# EAGLE design T00RA (EAGLE 9.6.1)
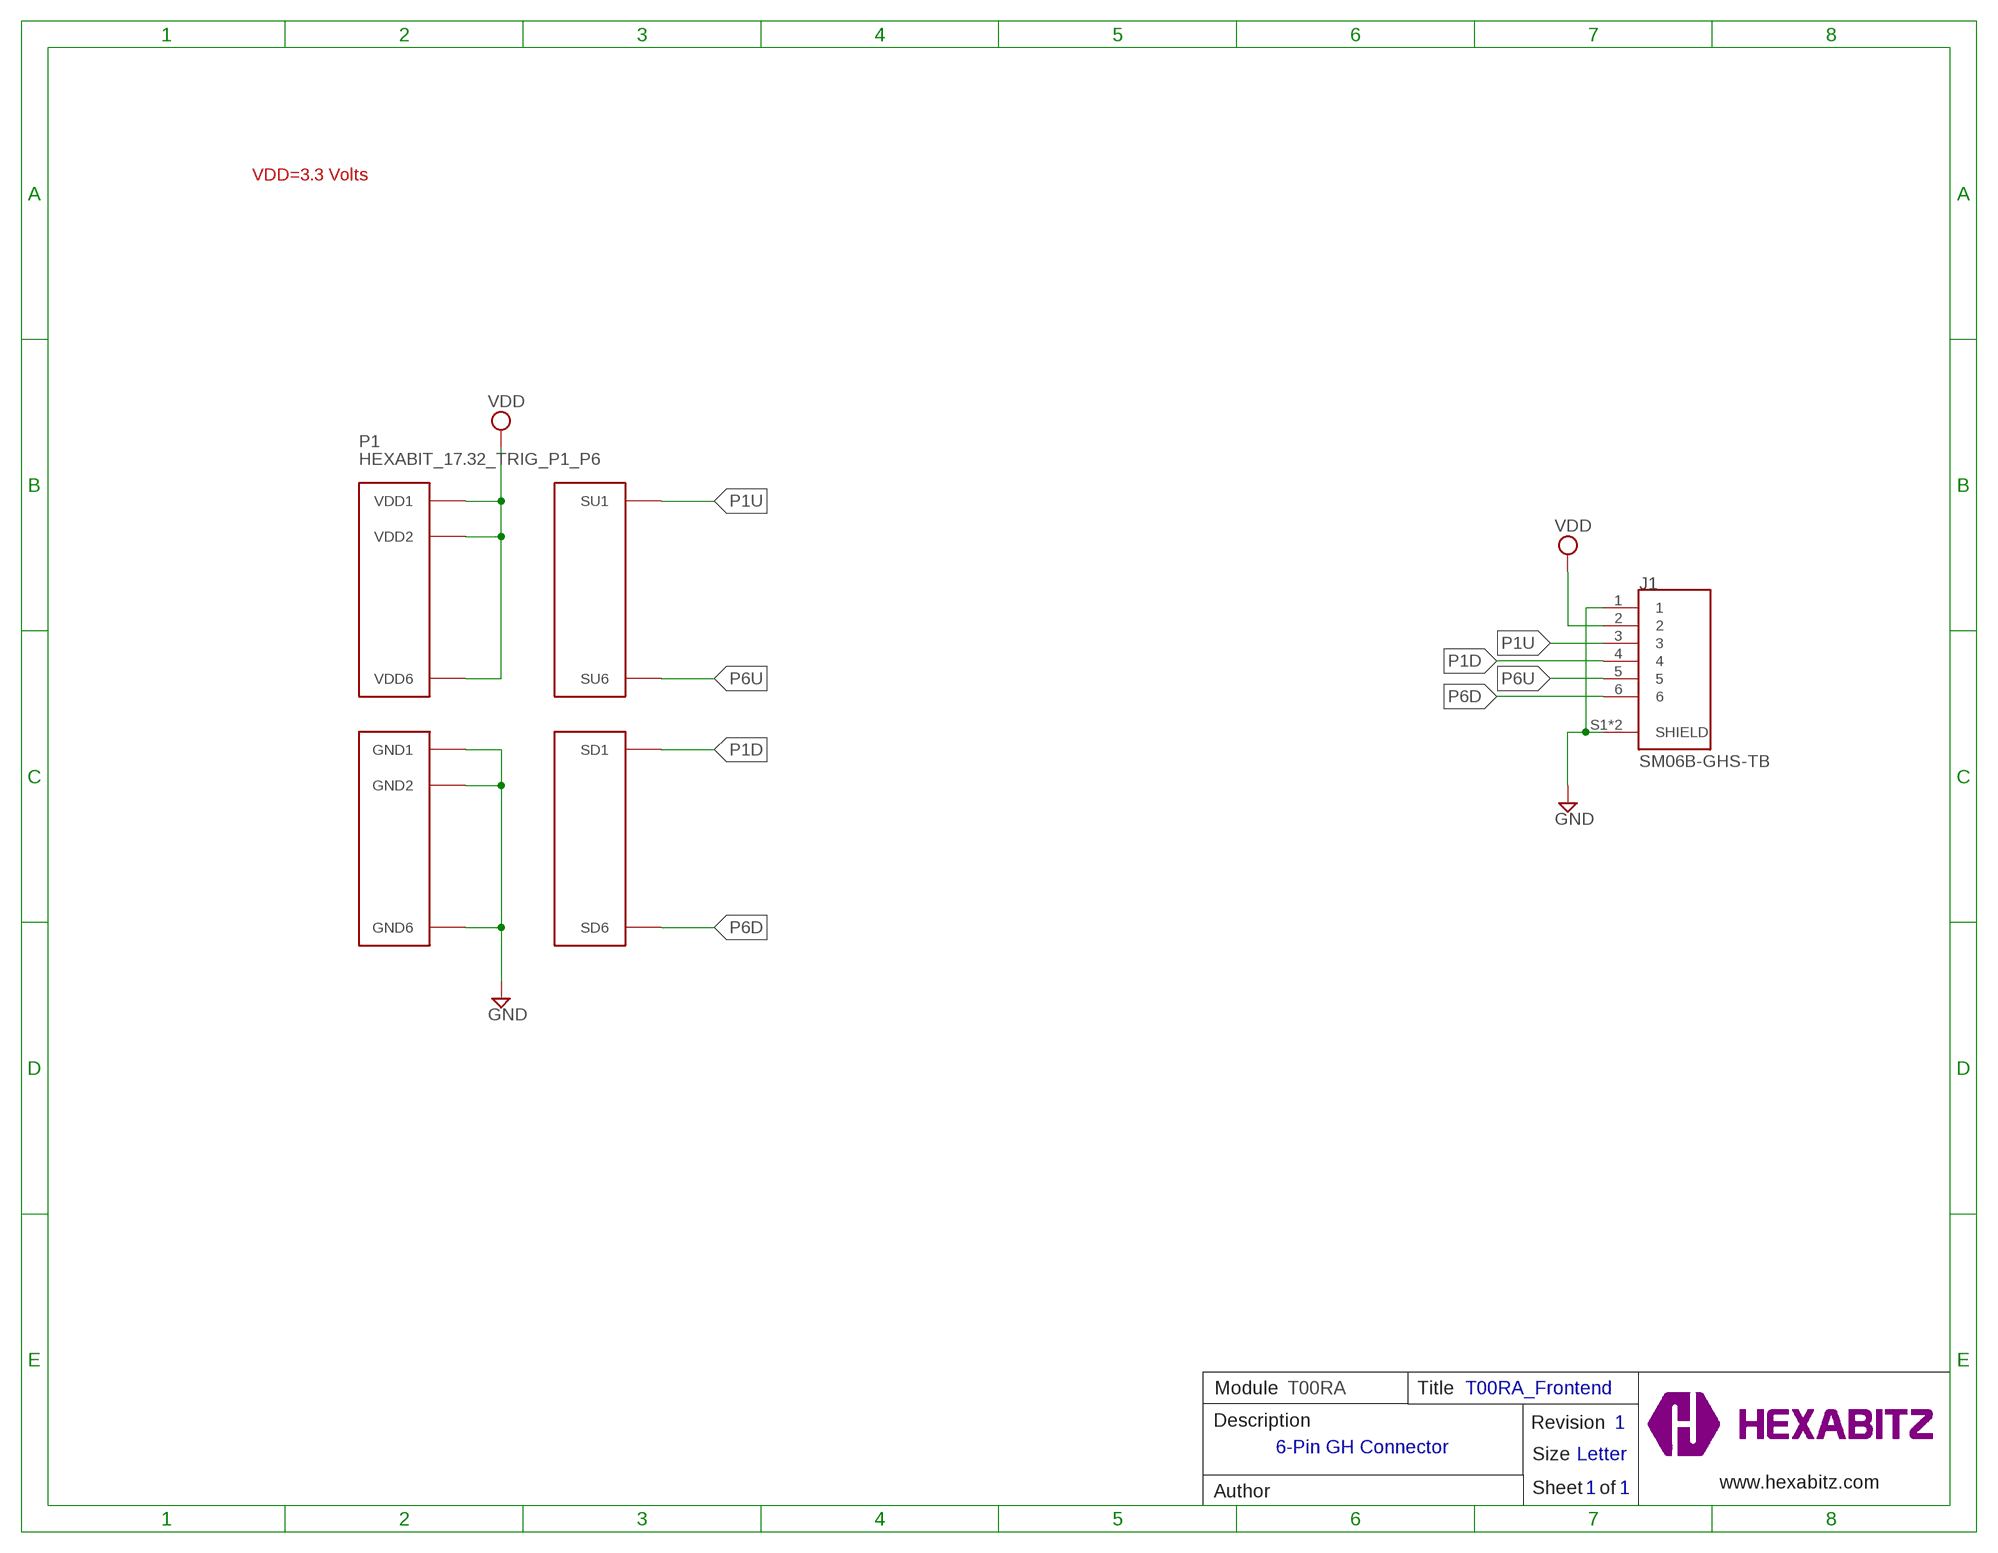
[diagram p0: schematic, sheet 1]

## Parts
J1  SM06B-GHS-TB  [JST_SM06B-GHS-TB]
P1  HEXABIT_17.32_TRIG_P1_P6  [HEXABIT_17.32_TRIG_P1_P6]

## Nets
GND: J1.1 J1.S1(SHIELD) J1.S2(SHIELD) P1.PAD_PD7(GND1) P1.PAD_PD8(GND2) P1.PAD_PD12(GND6)
P1D: J1.4 P1.PAD_PD1(SD1)
P1U: J1.3 P1.PAD_PU1(SU1)
P6D: J1.6 P1.PAD_PD6(SD6)
P6U: J1.5 P1.PAD_PU6(SU6)
VDD: J1.2 P1.PAD_PU7(VDD1) P1.PAD_PU8(VDD2) P1.PAD_PU12(VDD6)

## Notes on the sheet
- VDD=3.3 Volts
- Module | T00RA | Title | T00RA_Frontend
- Description | Revision | 1
- 6-Pin GH Connector
- Size | Letter
- www.hexabitz.com
- Author | Sheet   of | 1 | 1

## Library data of the parts
J1 = HEXABITZ_CONNECTION_PARTS:SM06B-GHS-TB: Conn Header Gh Side Entry 6pos 1.25mm
P1 = hexabitz_connectors:HEXABIT_17.32_TRIG_P1_P6: Hexabitz Hexagon Module Connector Hexagon side length = 17.32mm.

## Board
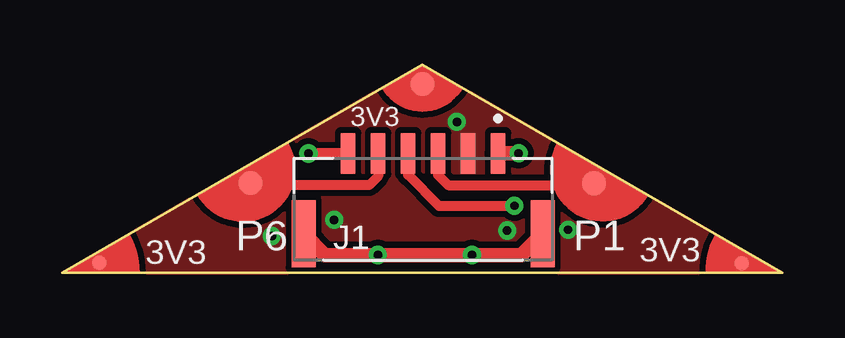
[diagram p1: board, top side]
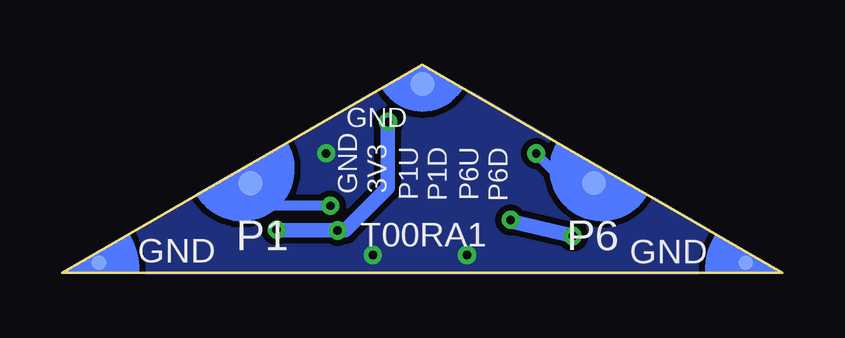
[diagram p2: board, bottom side, seen from below]

Size 30 x 8.66 mm. Coordinates in mm from the lower left corner, seen from the top.
Copper layers (1*16): Top 0.035mm / dielectric 1.5mm / Bottom 0.035mm
Design rules "2_layer *": minimum track width 7mil, minimum drill 10mil, track to track 6mil, track to pad 6mil, pad to pad 6mil, via to via 6mil, smd to smd 0mil, copper to edge 0mil, drill to drill 8mil, minimum pad ring 10mil, minimum via ring 8mil, stop-mask expansion 2mil, vias tented up to drill 15mil, thermal gap 10mil

### Footprints (pad centres in the part's own frame; a part is rotated, then mirrored left to right if it is on the bottom)
JST_SM06B-GHS-TB = smd 0.6 x 1.7: 1 3.125,3.35; 2 1.875,3.35; 3 0.625,3.35; 4 -0.625,3.35; 5 -1.875,3.35; 6 -3.125,3.35 | smd 1 x 2.8: S1 -4.975,0; S2 4.975,0
HEXABIT_17.32_TRIG_P1_P6 = smd 1 x 1 rotated 30 bottom: PAD_PD1 7.164,3.727; PAD_PD6 -7.146,3.733; PAD_PD7 0.008,7.863 | smd 0.61 x 0.61 rotated 30 bottom: PAD_PD8 13.484,0.417; PAD_PD12 -13.461,0.416 | smd 1 x 1 rotated 30: PAD_PU1 7.164,3.727; PAD_PU6 -7.146,3.733; PAD_PU7 0.008,7.863 | smd 0.61 x 0.61 rotated 30: PAD_PU8 13.316,0.401; PAD_PU12 -13.461,0.416

### Placement (x,y rotation side)
J1  15.03,1.62 0 top
P1  14.99,0 0 top

### Tracks (layer width: path | path; a pad name or v marks a point on that pad's centre or on a via)
GND  (via drill 0.35 pad 0.75)
  Top 0.61: J1.1 v19,4.97 v19.01,4.97 | J1.S2 19.12,0.74 v17.06,0.74 v13.14,0.74 10.94,0.74 J1.S1
  pour Bottom (isolate 0.254, no thermals): -0.02,-0.01 29.97,-0.01 14.99,8.67
P1D  (via drill 0.35)
  Top 0.406: J1.4 14.4,4.08 15.69,2.79 v18.83,2.79
  Bottom 0.406: v18.83,2.79 21.22,2.79 P1.PAD_PD1
P1U
  Top 0.406: J1.3 15.65,4.07 16.08,3.65 22.08,3.65 P1.PAD_PU1
P6D  (via drill 0.35)
  Top 0.406: J1.6 v10.26,4.97 v10.26,4.96
  Bottom 0.406: v10.26,4.96 9.02,3.73 P1.PAD_PD6
P6U
  Top 0.406: J1.5 13.15,4.02 12.78,3.65 7.93,3.65 P1.PAD_PU6
VDD  (via drill 0.35 pad 0.75)
  Bottom 0.406: 11.24,2.12 v11.32,2.2 | 21.04,1.76 v21.07,1.79
  Bottom 0.61: v8.73,1.53 11.24,2.12 | 21.04,1.76 v18.53,1.76 18.21,1.76 16.43,3.53 v16.43,6.29
  pour Top (isolate 0.254, no thermals): -0.02,-0.01 29.97,-0.01 14.99,8.66

### Text on the board
tPlace: 3V3 | 3V3 | P6 | P1 | 3V3
bPlace: GND | GND | P6 | P1 | GND
bNames: P6D | P6U | P1D | P1U | 3V3 | GND | T00RA1